# Altium schematic sheet BTNV1.SchDoc
size A3
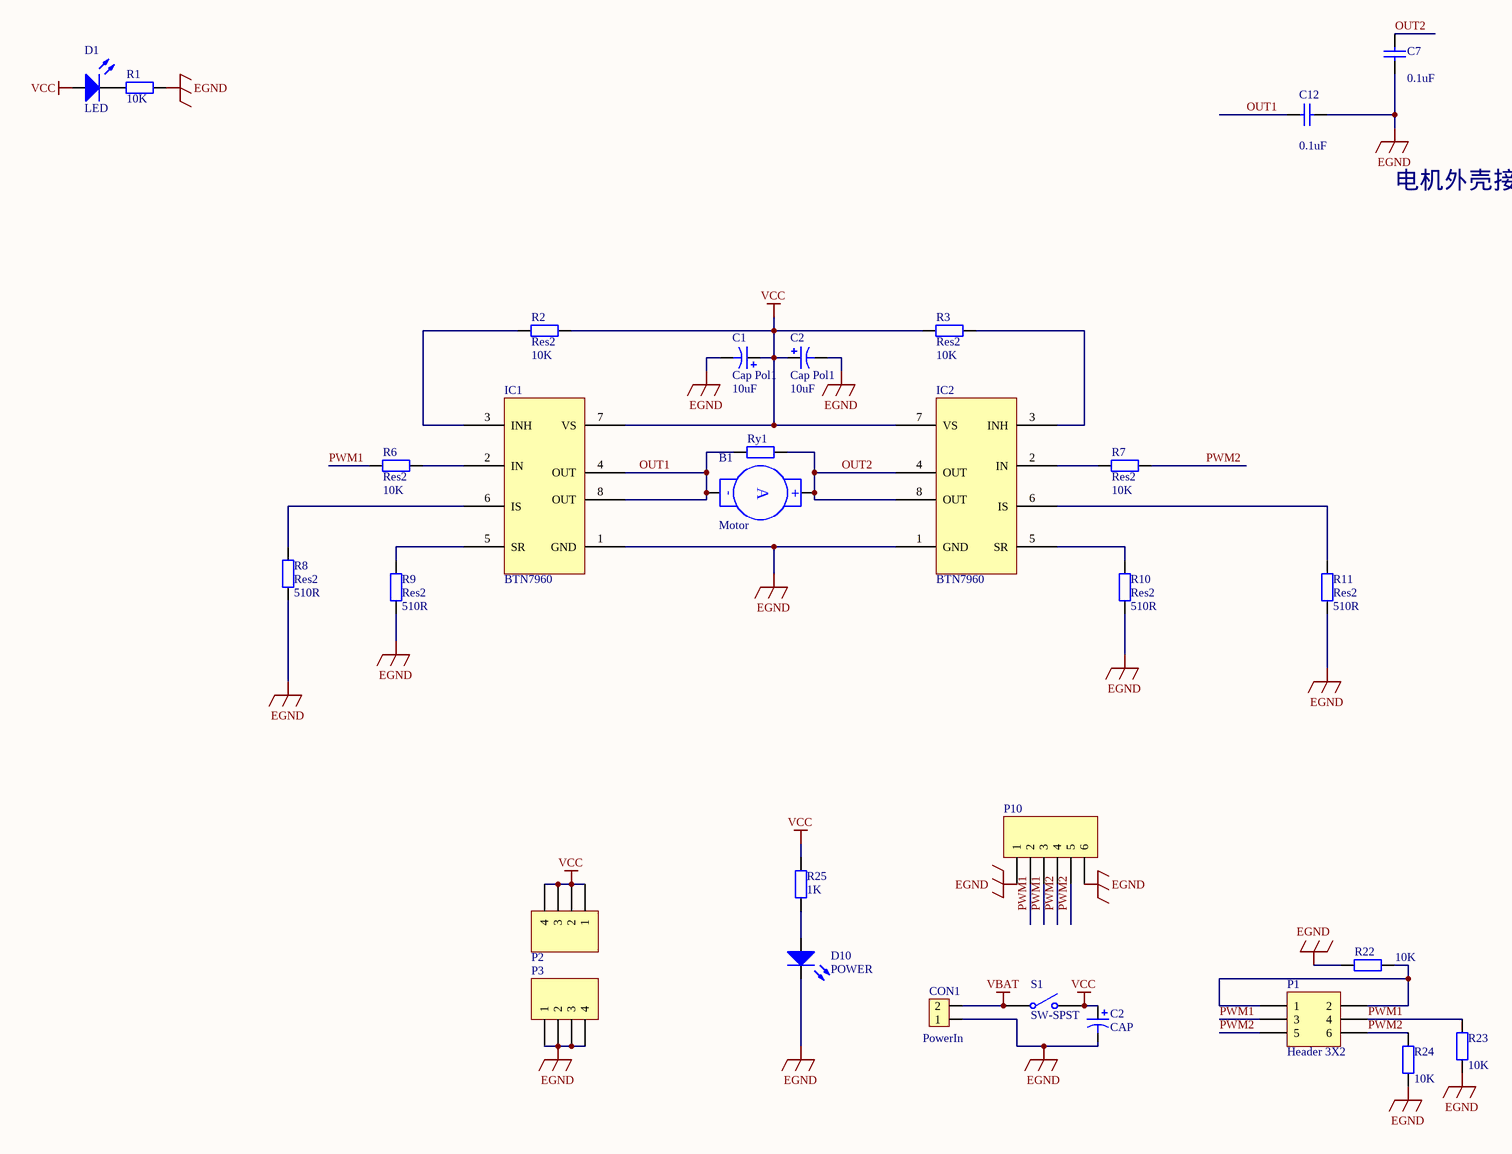
[diagram p0: BTNV1.SchDoc]

## Parts
(Parts that share a designator on the sheet are numbered #1, #2 ... from top to bottom, then left to right.)
B1  Motor  [KF301-2P]
C1  Cap Pol1  value 10uF  [1206(2)]
C2#1  Cap Pol1  value 10uF  [1206(2)]
C2#2  CAP  [SMD-EC-F8]
C7  value 0.1uF  [C2012]  (hidden comment: Cap)
C12  value 0.1uF  [C2012]  (hidden comment: Cap)
CON1  PowerIn  [KF301-2P]
D1  LED  [1206(2)]
D10  POWER  [C2012]
IC1  BTN7960  [PG-TO263-7-1]
IC2  BTN7960  [PG-TO263-7-1]
P1  Header 3X2  [HDR2X3]
P2  Header 4  [HDR1X4]  (value not drawn)
P3  Header 4  [HDR1X4]  (value not drawn)
P10  Header 6  [FFC/SM1.0-2H6]  (value not drawn)
R1  10K  [1206(2)]
R2  Res2  value 10K  [1206(2)]
R3  Res2  value 10K  [1206(2)]
R6  Res2  value 10K  [1206(2)]
R7  Res2  value 10K  [1206(2)]
R8  Res2  value 510R  [1206(2)]
R9  Res2  value 510R  [1206(2)]
R10  Res2  value 510R  [1206(2)]
R11  Res2  value 510R  [1206(2)]
R22  value 10K  [1206(2)]  (hidden comment: Res2)
R23  value 10K  [R2012]  (hidden comment: Res2)
R24  value 10K  [R2012]  (hidden comment: Res2)
R25  1K  [R2012]
Ry1  (no value)  [1206(2)]
S1  SW-SPST  [SW-125V6A(-)]

## Nets
EGND: C1.2 C2#1.2 C2#2.2 C7.2 C12.2 CON1.1 D10.2 IC1.1(GND) IC2.1(GND) P3.1 P3.2 P3.3 P3.4 P10.1 P10.6 R1.1 R8.1 R9.1 R10.1 R11.1 R22.1 R23.1 R24.1
VBAT: CON1.2 S1.1(COMMON)
VCC: C1.1 C2#1.1 C2#2.1 D1.1 IC1.7(VS) IC2.7(VS) P2.1 P2.2 P2.3 P2.4 R2.2 R3.1 R25.2 S1.2(NO)
OUT1: B1.2(-) C12.1 IC1.4(OUT) IC1.8(OUT) Ry1.1
OUT2: B1.1(+) C7.1 IC2.4(OUT) IC2.8(OUT) Ry1.2
PWM1: P1.3 P1.4 P10.2 P10.3 R6.1 R23.2
PWM2: P1.5 P1.6 P10.4 P10.5 R7.2 R24.2
NetD1_2: D1.2 R1.2
NetD10_1: D10.1 R25.1
NetIC1_2: IC1.2(IN) R6.2
NetIC1_3: IC1.3(INH) R2.1
NetIC1_5: IC1.5(SR) R9.2
NetIC1_6: IC1.6(IS) R8.2
NetIC2_2: IC2.2(IN) R7.1
NetIC2_3: IC2.3(INH) R3.2
NetIC2_5: IC2.5(SR) R10.2
NetIC2_6: IC2.6(IS) R11.2
NetP1_1: P1.1 P1.2 R22.2

## Notes on the sheet
- 电机外壳接地
- (in symbol Motor Servo) A

## Library data of the parts
B1 = Motor Servo: Servo Motor
C1 C2#1 = Cap Pol1: Polarized Capacitor (Radial); Published: 8-Jun-2000; LatestRevisionDate: 17-Jul-2002; LatestRevisionNote: Re-released for DXP Platform.; PackageReference: RB7.6-15; Publisher: Altium Limited; PackageDescription: Polarized Capacitor (Radial); 2 Leads
C2#2 = CAP+
C7 C12 = Cap: Capacitor; Published: 8-Jun-2000; LatestRevisionDate: 17-Jul-2002; LatestRevisionNote: Re-released for DXP Platform.; PackageReference: RAD-0.3; Publisher: Altium Limited; PackageDescription: Radial Cap, Thru-Hole; 2 Leads; 0.3 in Pin Spacing
CON1 = Header 2: Header, 2-Pin
D1 D10 = LED: Typical INFRARED GaAs LED
P1 = Header 3X2: Header, 3-Pin, Dual row; LatestRevisionDate: 17-Jul-2002; LatestRevisionNote: Re-released for DXP Platform.; Publisher: Altium Limited
P2 P3 = Header 4: Header, 4-Pin; LatestRevisionDate: 17-Jul-2002; LatestRevisionNote: Re-released for DXP Platform.; Publisher: Altium Limited
P10 = Header 6: Header, 6-Pin; LatestRevisionDate: 17-Jul-2002; LatestRevisionNote: Re-released for DXP Platform.; Publisher: Altium Limited
R1 Ry1 = Res: Resistor
R2 R3 R6-R11 R22-R24 = Res2: Resistor; Published: 8-Jun-2000; LatestRevisionDate: 17-Jul-2002; LatestRevisionNote: Re-released for DXP Platform.; PackageReference: AXIAL-0.4; Publisher: Altium Limited; PackageDescription: Axial Device, Thru-Hole; 2 Leads; 0.4 in Pin Spacing
R25 = Res: Resistor of led
S1 = SW-SPST: Single-Pole, Single-Throw Switch; Published: 24-Mar-1999; LatestRevisionDate: 17-Jul-2002; LatestRevisionNote: Re-released for DXP Platform.; PackageReference: SPST-2; Publisher: Altium Limited